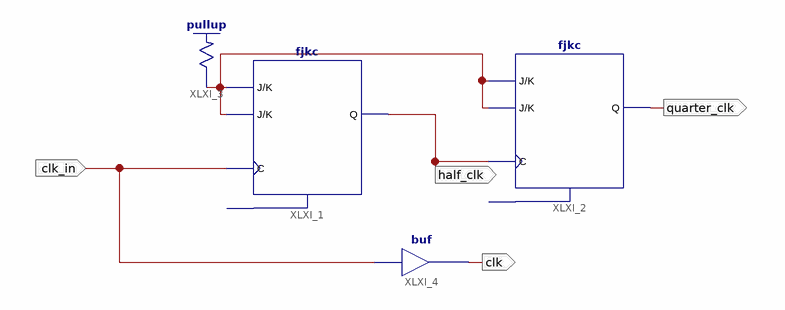
[diagram p0: schematic sheet 1]
// Xilinx ISE schematic DivClock.sch (spartan3e) as structural Verilog: 4 symbols, 4 ports
module DivClock (
  input  clk_in,
  output half_clk,
  output quarter_clk,
  output clk
);

  wire XLXN_1;

  fjkc XLXI_1 (.C(clk_in), .J(XLXN_1), .K(XLXN_1), .Q(half_clk));  // open: CLR
  fjkc XLXI_2 (.C(half_clk), .J(XLXN_1), .K(XLXN_1), .Q(quarter_clk));  // open: CLR
  \pullup  XLXI_3 (.O(XLXN_1));
  buf XLXI_4 (clk, clk_in);
endmodule
